# EAGLE board 1-13-2013 (EAGLE 6.4)
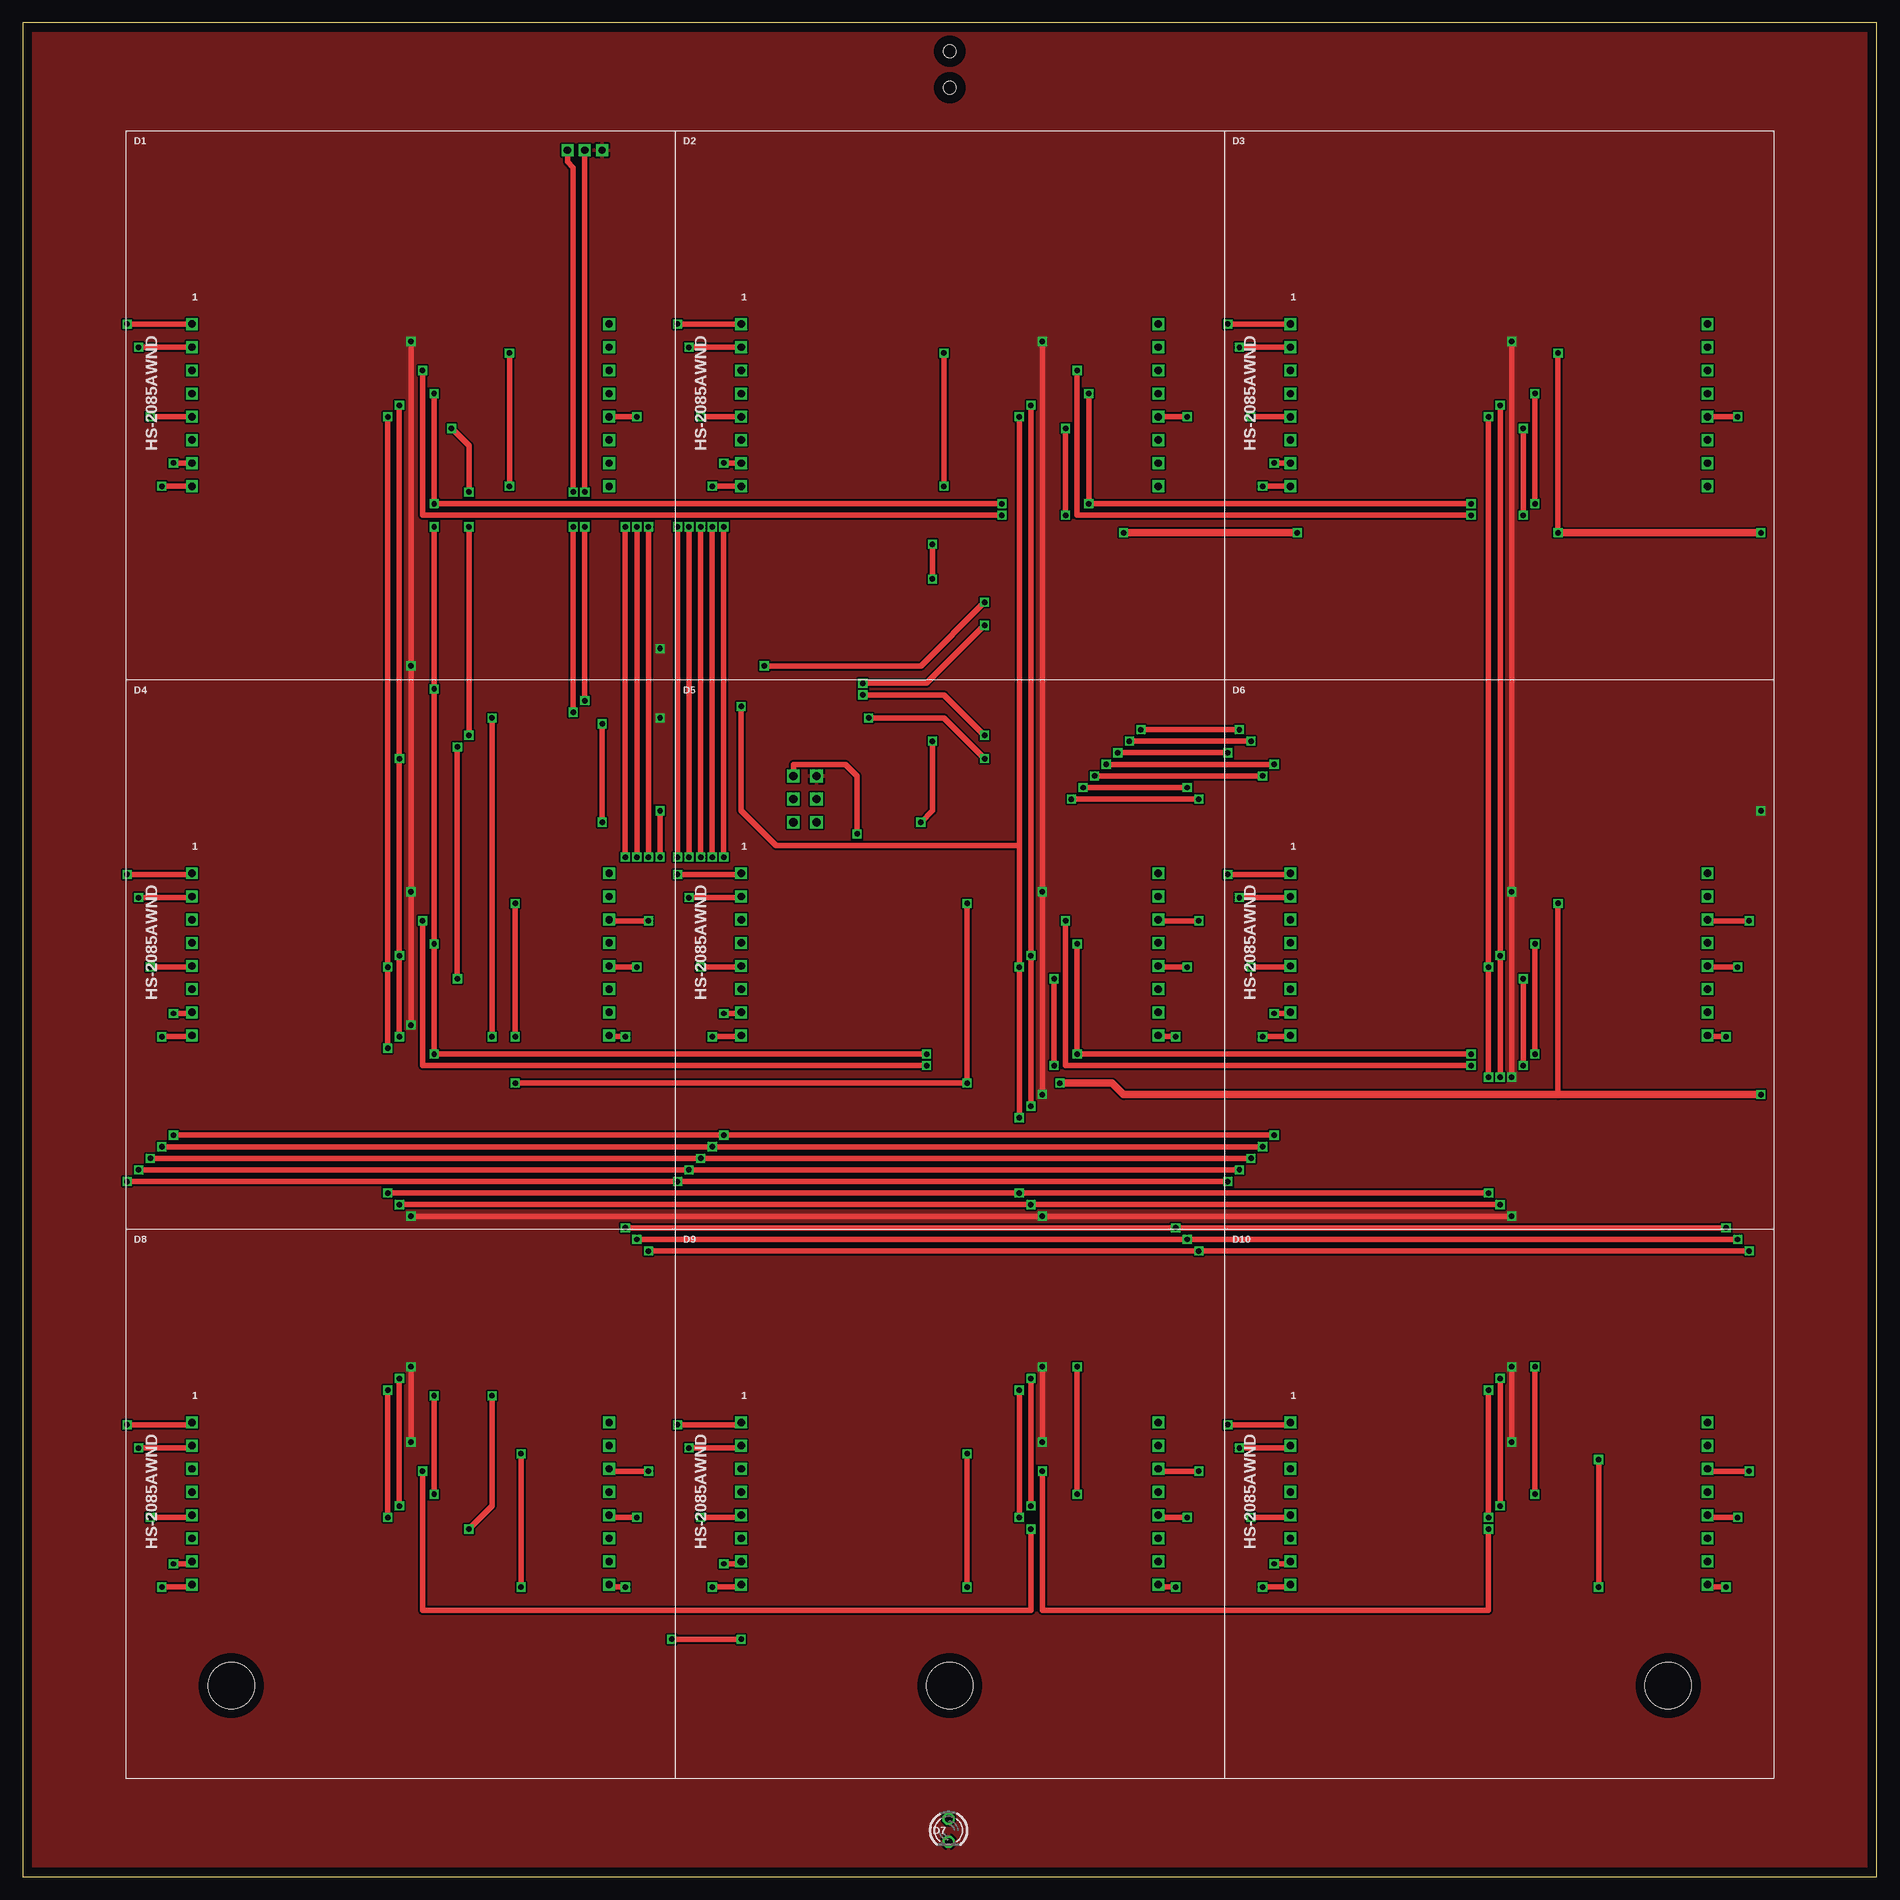
[diagram p2: board, top side]
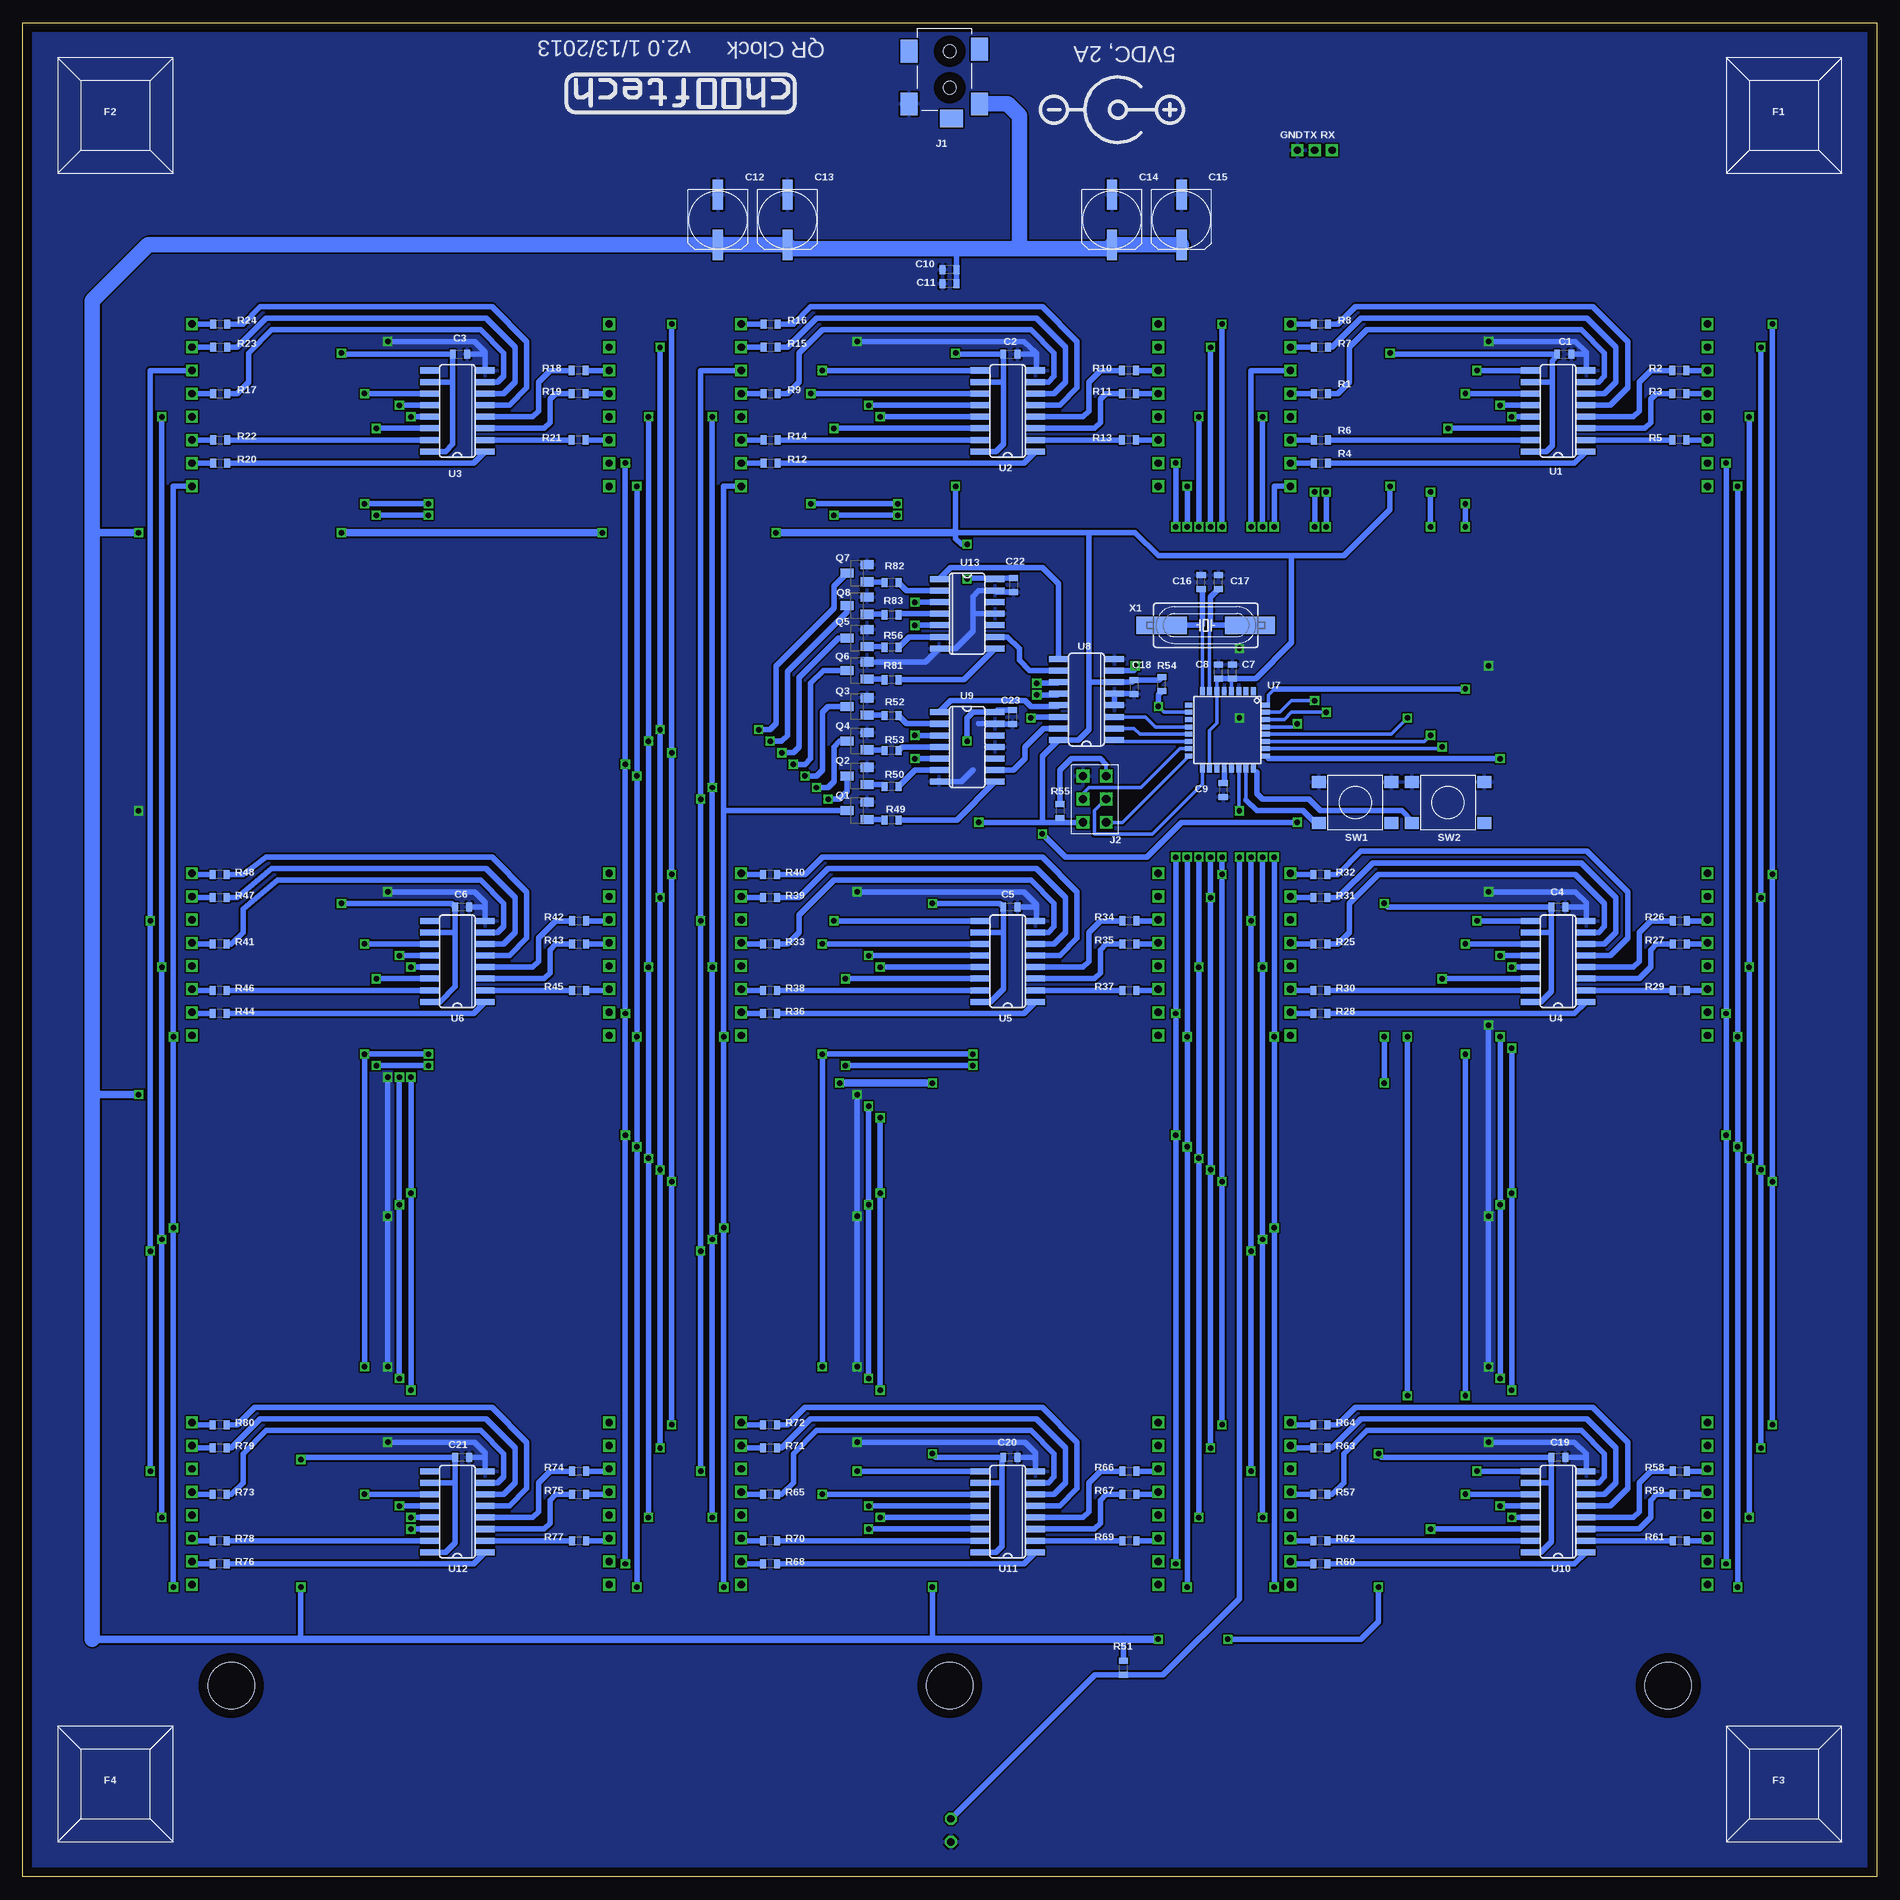
[diagram p3: board, bottom side, seen from below]

Size 203.2 x 203.2 mm. Coordinates in mm from the lower left corner, seen from the top.
Outline: 0,0 203.2,0 203.2,203.2 0,203.2 0,0
Copper layers (1*16): Top 0.035mm / dielectric 1.5mm / Bottom 0.035mm
Design rules "default *": minimum track width 10mil, minimum drill 6mil, track to track 8mil, track to pad 8mil, pad to pad 8mil, via to via 8mil, smd to smd 8mil, copper to edge 40mil, drill to drill 8mil, minimum pad ring 10mil, minimum via ring 8mil, stop-mask expansion 4mil, vias tented up to drill 25mil, thermal gap 10mil
Holes 5.08 mm at 101.6,20.95 180.34,20.95 22.86,20.95

## Footprints (pad centres in the part's own frame; a part is rotated, then mirrored left to right if it is on the bottom)
0603/1608METRIC = smd 0.65 x 1: P1 -0.74,0; P2 0.8,0
CAP-UWX-6.3 = smd 1.143 x 3.302: + 0,2.751; - 0,-2.751
HS-2085BX = drill 0.8 square: P1 -22.86,8.89; P2 -22.86,6.35; P3 -22.86,3.81; P4 -22.86,1.27; P5 -22.86,-1.27; P6 -22.86,-3.81; P7 -22.86,-6.35; P8 -22.86,-8.89; P9 22.86,-8.89; P10 22.86,-6.35; P11 22.86,-3.81; P12 22.86,-1.27; P13 22.86,1.27; P14 22.86,3.81; P15 22.86,6.35; P16 22.86,8.89
LED3MM = drill 0.813 octagon: A -1.27,0; K 1.27,0
HEADERPIN = drill 0.8 square: P$1 0,0
PJ-075DH-SMT-TR = smd 2.489 x 1.88: 1 8.255,3.251; 2 8.255,-4.47; NC1 2.261,3.251; NC2 2.489,-4.47 | smd 1.88 x 2.489: 3 9.855,0.203 | hole 1.397: 2.489,0; 6.477,0
ATMEL-PROGRAMMING-HEADER = drill 0.9 square: P1 -2.54,-1.27; P2 -2.54,1.27; P3 0,-1.27; P4 0,1.27; P5 2.54,-1.27; P6 2.54,1.27
SOT23 = smd 1 x 1.4: 1 -0.95,-1.1; 2 0.95,-1.1; 3 0,1.1
PTS645SM43SMTRLFS = smd 1.549 x 1.295: P1 -3.975,2.248; P2 3.975,2.248; P3 -3.975,-2.248; P4 3.975,-2.248
SO16 = smd 0.66 x 2.032: 1 -4.445,-3.073; 2 -3.175,-3.073; 3 -1.905,-3.073; 4 -0.635,-3.073; 5 0.635,-3.073; 6 1.905,-3.073; 7 3.175,-3.073; 8 4.445,-3.073; 9 4.445,3.073; 10 3.175,3.073; 11 1.905,3.073; 12 0.635,3.073; 13 -0.635,3.073; 14 -1.905,3.073; 15 -3.175,3.073; 16 -4.445,3.073
TQFP-32 = smd 0.85 x 0.54: P1 -4.22,2.8; P2 -4.22,2; P3 -4.22,1.2; P4 -4.22,0.4; P5 -4.22,-0.4; P6 -4.22,-1.2; P7 -4.22,-2; P8 -4.22,-2.8; P17 4.28,-2.8; P18 4.28,-2; P19 4.28,-1.2; P20 4.28,-0.4; P21 4.28,0.4; P22 4.28,1.2; P23 4.28,2; P24 4.28,2.8 | smd 0.54 x 0.85: P9 -2.7,-4.28; P10 -1.9,-4.28; P11 -1.1,-4.28; P12 -0.3,-4.28; P13 0.5,-4.28; P14 1.3,-4.28; P15 2.1,-4.28; P16 2.9,-4.28; P25 2.9,4.18; P26 2.1,4.18; P27 1.3,4.18; P28 0.5,4.18; P29 -0.3,4.18; P30 -1.1,4.18; P31 -1.9,4.18; P32 -2.7,4.18
SO14 = smd 0.66 x 2.032: 1 -3.81,-3.073; 2 -2.54,-3.073; 3 -1.27,-3.073; 4 0,-3.073; 5 1.27,-3.073; 6 2.54,-3.073; 7 3.81,-3.073; 8 3.81,3.073; 9 2.54,3.073; 10 1.27,3.073; 11 0,3.073; 12 -1.27,3.073; 13 -2.54,3.073; 14 -3.81,3.073
HC49UP = smd 5.5 x 1.93: 1 -4.826,0; 2 4.826,0

## Placement (x,y rotation side)
C1  .1uF  [0603/1608METRIC]  34.29,166.88 0 bottom
C2  .1uF  [0603/1608METRIC]  95,166.88 0 bottom
C3  .1uF  [0603/1608METRIC]  155.32,166.88 0 bottom
C4  .1uF  [0603/1608METRIC]  34.92,106.3 0 bottom
C5  .1uF  [0603/1608METRIC]  95,106.3 0 bottom
C6  .1uF  [0603/1608METRIC]  155.07,106.3 0 bottom
C7  .1uF  [0603/1608METRIC]  70.61,132.08 90 bottom
C8  .1uF  [0603/1608METRIC]  72.14,132.08 90 bottom
C9  .1uF  [0603/1608METRIC]  71.63,119.13 270 bottom
C10  1uF  [0603/1608METRIC]  101.6,176.15 180 bottom
C11  1uF  [0603/1608METRIC]  101.6,174.62 180 bottom
C12  100uF  [CAP-UWX-6.3]  127,181.61 180 bottom
C13  100uF  [CAP-UWX-6.3]  119.38,181.61 180 bottom
C14  100uF  [CAP-UWX-6.3]  83.82,181.61 180 bottom
C15  100uF  [CAP-UWX-6.3]  76.2,181.61 180 bottom
C16  22pF  [0603/1608METRIC]  74.04,141.86 90 bottom
C17  22pF  [0603/1608METRIC]  72.14,141.86 90 bottom
C18  .1uF  [0603/1608METRIC]  81.41,130.43 270 bottom
C19  .1uF  [0603/1608METRIC]  34.92,45.97 0 bottom
C20  .1uF  [0603/1608METRIC]  95,45.97 0 bottom
C21  .1uF  [0603/1608METRIC]  155.07,45.97 0 bottom
C22  .1uF  [0603/1608METRIC]  94.61,141.6 270 bottom
C23  .1uF  [0603/1608METRIC]  94.74,127.13 270 bottom
D1  WHITE  [HS-2085BX]  41.4,161.29 0 top
D2  WHITE  [HS-2085BX]  101.6,161.29 0 top
D3  WHITE  [HS-2085BX]  161.8,161.29 0 top
D4  WHITE  [HS-2085BX]  41.4,101.09 0 top
D5  WHITE  [HS-2085BX]  101.6,101.09 0 top
D6  WHITE  [HS-2085BX]  161.8,101.09 0 top
D7  TEPT4400  [LED3MM]  101.47,5.08 270 top
D8  WHITE  [HS-2085BX]  41.4,40.89 0 top
D9  WHITE  [HS-2085BX]  101.6,40.89 0 top
D10  WHITE  [HS-2085BX]  161.8,40.89 0 top
F1  RUBBER-FOOT  [SJ-5518]  10.16,193.04 0 bottom
F2  RUBBER-FOOT  [SJ-5518]  193.04,193.04 0 bottom
F3  RUBBER-FOOT  [SJ-5518]  10.16,10.16 0 bottom
F4  RUBBER-FOOT  [SJ-5518]  193.04,10.16 0 bottom
GND  HEADERPIN  [HEADERPIN]  63.5,189.23 0 bottom
J1  DC-BARREL-JACK-SWITCH  [PJ-075DH-SMT-TR]  101.6,202.56 270 bottom
J2  PROGHEADER-PINS  [ATMEL-PROGRAMMING-HEADER]  85.72,118.11 90 bottom
Q1  FDN335  [SOT23]  111.76,116.84 90 bottom
Q2  FDN335  [SOT23]  111.76,120.65 90 bottom
Q3  FDN335  [SOT23]  111.76,128.27 90 bottom
Q4  FDN335  [SOT23]  111.76,124.46 90 bottom
Q5  FDN335  [SOT23]  111.76,135.76 90 bottom
Q6  FDN335  [SOT23]  111.76,132.21 90 bottom
Q7  FDN335  [SOT23]  111.76,142.88 90 bottom
Q8  FDN335  [SOT23]  111.76,139.32 90 bottom
R1  62  [0603/1608METRIC]  60.96,162.56 0 bottom
R2  62  [0603/1608METRIC]  21.59,165.1 180 bottom
R3  62  [0603/1608METRIC]  21.59,162.56 180 bottom
R4  62  [0603/1608METRIC]  60.96,154.94 0 bottom
R5  62  [0603/1608METRIC]  21.59,157.48 180 bottom
R6  62  [0603/1608METRIC]  60.96,157.48 0 bottom
R7  62  [0603/1608METRIC]  60.96,167.64 0 bottom
R8  62  [0603/1608METRIC]  60.96,170.18 0 bottom
R9  62  [0603/1608METRIC]  121.28,162.56 0 bottom
R10  62  [0603/1608METRIC]  81.92,165.1 180 bottom
R11  62  [0603/1608METRIC]  81.92,162.56 180 bottom
R12  62  [0603/1608METRIC]  121.28,154.94 0 bottom
R13  62  [0603/1608METRIC]  81.92,157.48 180 bottom
R14  62  [0603/1608METRIC]  121.28,157.48 0 bottom
R15  62  [0603/1608METRIC]  121.28,167.64 0 bottom
R16  62  [0603/1608METRIC]  121.28,170.18 0 bottom
R17  62  [0603/1608METRIC]  181.61,162.56 0 bottom
R18  62  [0603/1608METRIC]  142.24,165.1 180 bottom
R19  62  [0603/1608METRIC]  142.24,162.56 180 bottom
R20  62  [0603/1608METRIC]  181.61,154.94 0 bottom
R21  62  [0603/1608METRIC]  142.24,157.48 180 bottom
R22  62  [0603/1608METRIC]  181.61,157.48 0 bottom
R23  62  [0603/1608METRIC]  181.61,167.64 0 bottom
R24  62  [0603/1608METRIC]  181.61,170.18 0 bottom
R25  62  [0603/1608METRIC]  60.96,102.23 180 bottom
R26  62  [0603/1608METRIC]  21.59,104.78 0 bottom
R27  62  [0603/1608METRIC]  21.59,102.23 0 bottom
R28  62  [0603/1608METRIC]  60.96,94.61 180 bottom
R29  62  [0603/1608METRIC]  21.59,97.16 0 bottom
R30  62  [0603/1608METRIC]  60.96,97.16 180 bottom
R31  62  [0603/1608METRIC]  60.96,107.31 180 bottom
R32  62  [0603/1608METRIC]  60.96,109.86 180 bottom
R33  62  [0603/1608METRIC]  121.28,102.23 180 bottom
R34  62  [0603/1608METRIC]  81.92,104.78 0 bottom
R35  62  [0603/1608METRIC]  81.92,102.23 0 bottom
R36  62  [0603/1608METRIC]  121.28,94.61 180 bottom
R37  62  [0603/1608METRIC]  81.92,97.16 0 bottom
R38  62  [0603/1608METRIC]  121.28,97.16 180 bottom
R39  62  [0603/1608METRIC]  121.28,107.31 180 bottom
R40  62  [0603/1608METRIC]  121.28,109.86 180 bottom
R41  62  [0603/1608METRIC]  181.61,102.23 180 bottom
R42  62  [0603/1608METRIC]  142.24,104.78 0 bottom
R43  62  [0603/1608METRIC]  142.24,102.23 0 bottom
R44  62  [0603/1608METRIC]  181.61,94.61 180 bottom
R45  62  [0603/1608METRIC]  142.24,97.16 0 bottom
R46  62  [0603/1608METRIC]  181.61,97.16 180 bottom
R47  62  [0603/1608METRIC]  181.61,107.31 180 bottom
R48  62  [0603/1608METRIC]  181.61,109.86 180 bottom
R49  2k  [0603/1608METRIC]  107.95,115.82 180 bottom
R50  2k  [0603/1608METRIC]  107.95,119.51 180 bottom
R51  47k  [0603/1608METRIC]  82.55,22.86 90 bottom
R52  2k  [0603/1608METRIC]  107.95,127.25 180 bottom
R53  2k  [0603/1608METRIC]  107.95,123.44 180 bottom
R54  10k  [0603/1608METRIC]  78.36,130.68 90 bottom
R55  4.7k  [0603/1608METRIC]  89.53,116.84 270 bottom
R56  2k  [0603/1608METRIC]  107.95,134.75 180 bottom
R57  62  [0603/1608METRIC]  60.96,41.91 180 bottom
R58  62  [0603/1608METRIC]  21.59,44.45 0 bottom
R59  62  [0603/1608METRIC]  21.59,41.91 0 bottom
R60  62  [0603/1608METRIC]  60.96,34.29 180 bottom
R61  62  [0603/1608METRIC]  21.59,36.83 0 bottom
R62  62  [0603/1608METRIC]  60.96,36.83 180 bottom
R63  62  [0603/1608METRIC]  60.96,46.99 180 bottom
R64  62  [0603/1608METRIC]  60.96,49.53 180 bottom
R65  62  [0603/1608METRIC]  121.28,41.91 180 bottom
R66  62  [0603/1608METRIC]  81.92,44.45 0 bottom
R67  62  [0603/1608METRIC]  81.92,41.91 0 bottom
R68  62  [0603/1608METRIC]  121.28,34.29 180 bottom
R69  62  [0603/1608METRIC]  81.92,36.83 0 bottom
R70  62  [0603/1608METRIC]  121.28,36.83 180 bottom
R71  62  [0603/1608METRIC]  121.28,46.99 180 bottom
R72  62  [0603/1608METRIC]  121.28,49.53 180 bottom
R73  62  [0603/1608METRIC]  181.61,41.91 180 bottom
R74  62  [0603/1608METRIC]  142.24,44.45 0 bottom
R75  62  [0603/1608METRIC]  142.24,41.91 0 bottom
R76  62  [0603/1608METRIC]  181.61,34.29 180 bottom
R77  62  [0603/1608METRIC]  142.24,36.83 0 bottom
R78  62  [0603/1608METRIC]  181.61,36.83 180 bottom
R79  62  [0603/1608METRIC]  181.61,46.99 180 bottom
R80  62  [0603/1608METRIC]  181.61,49.53 180 bottom
R81  2k  [0603/1608METRIC]  107.95,131.19 180 bottom
R82  2k  [0603/1608METRIC]  107.95,141.86 180 bottom
R83  2k  [0603/1608METRIC]  107.95,138.3 180 bottom
RX  HEADERPIN  [HEADERPIN]  59.69,189.23 0 bottom
SW1  4mm  [PTS645SM43SMTRLFS]  57.15,117.73 180 bottom
SW2  4mm  [PTS645SM43SMTRLFS]  46.99,117.73 180 bottom
TX  HEADERPIN  [HEADERPIN]  61.59,189.23 0 bottom
U1  74HC595  [SO16]  34.92,160.66 90 bottom
U2  74HC595  [SO16]  95.25,160.66 90 bottom
U3  74HC595  [SO16]  155.57,160.66 90 bottom
U4  74HC595  [SO16]  34.92,100.33 90 bottom
U5  74HC595  [SO16]  95.25,100.33 90 bottom
U6  74HC595  [SO16]  155.57,100.33 90 bottom
U7  ATMega328A  [TQFP-32]  71.12,125.73 270 bottom
U8  74HC138  [SO16]  86.61,129.03 90 bottom
U9  74HC14  [SO14]  99.69,123.83 270 bottom
U10  74HC595  [SO16]  34.92,40.01 90 bottom
U11  74HC595  [SO16]  95.25,40.01 90 bottom
U12  74HC595  [SO16]  155.57,40.01 90 bottom
U13  74HC14  [SO14]  99.69,138.43 270 bottom
X1  11.0592MHz  [HC49UP]  73.53,137.16 180 bottom

## Tracks (layer width: path | path; a pad name or v marks a point on that pad's centre or on a via)
!OE  (via drill 0.6)
  Top 0.61: v40.01,160.02 v40.01,99.69 v40.01,90.81 | v40.01,39.37 v40.01,53.34 | v109.22,39.37 v109.22,53.34 | v109.22,83.19 v109.22,99.69 109.22,113.03 | 109.22,113.03 v109.22,160.02 | v160.66,39.37 v160.66,53.34 | v160.66,87.63 v160.66,99.69 v160.66,160.02 | v40.01,74.93 v109.22,74.93 v160.66,74.93 | v78.74,128.27 78.74,116.84 82.55,113.03 109.22,113.03
  Bottom 0.406: U7.P10 78.1,127.63 v78.74,128.27
  Bottom 0.61: U1.13 v40.01,160.02 | v40.01,99.69 U4.13 | U10.13 v40.01,39.37 | v40.01,53.34 v40.01,74.93 v40.01,90.81 | U11.13 v109.22,39.37 | v109.22,53.34 v109.22,74.93 v109.22,83.19 | v109.22,160.02 U2.13 | U5.13 v109.22,99.69 | U12.13 v160.66,39.37 | v160.66,53.34 v160.66,74.93 v160.66,87.63 | U3.13 v160.66,160.02 | U6.13 v160.66,99.69 | v78.74,128.27 78.74,129.56 R54.P1
!RESET  (via drill 0.6)
  Top 0.61: v63.5,115.57 v63.5,126.36 | J2.P5 84.45,121.92 90.17,121.92 91.44,120.65 v91.44,114.3
  Bottom 0.406: v63.5,126.36 63.84,126.03 U7.P29 | 84.45,121.92 J2.P5
  Bottom 0.61: R55.P1 89.53,121.28 88.27,122.56 85.09,122.56 84.45,121.92 | v63.5,115.57 76.2,115.57 80.01,111.76 88.9,111.76 v91.44,114.3
+5V  (via drill 0.6)
  Top 0.61: v168.28,167 v168.28,147.32 | v100.97,152.4 v100.97,167 | v53.34,152.4 v53.34,167 | 168.28,85.72 v168.28,106.68 | v103.5,106.68 v103.5,87 v53.98,87 | v53.98,92.08 v53.98,106.68 | v78.74,26.04 v71.12,26.04 | v54.61,31.75 v54.61,46.35 | v103.5,31.75 v103.5,46.35 | v172.72,31.75 v172.72,45.72 | v99.69,142.24 v99.69,146.05 | v99.69,124.46 99.69,116.84 v98.42,115.57
  Top 0.813: v168.28,147.32 v190.5,147.32 | v139.7,147.32 v120.65,147.32 | v190.5,85.72 168.28,85.72 120.65,85.72 119.38,87 v113.67,87
  Bottom 0.406: 72.32,131.16 U7.P6 72.32,126.44 73.12,125.64 U7.P18 | U7.P4 70.72,131.23 | R55.P2 89.53,115.57
  Bottom 0.61: U1.16 36.2,156.21 35.56,156.84 35.56,163.83 | U2.16 96.52,156.21 95.74,156.99 95.74,163.83 | 95.74,163.83 U2.10 | U3.16 156.84,156.21 156.06,156.99 156.06,163.83 | 156.06,163.83 U3.10 | U1.10 35.56,163.83 | 35.56,163.83 35.56,166.09 C1.P1 53.21,166.88 v53.34,167 | U4.16 36.83,95.89 35.66,97.05 35.66,103.5 | U10.16 36.83,35.56 35.66,36.73 35.66,43.18 | 35.66,43.18 C19.P1 54.23,45.97 v54.61,46.35 | U10.10 35.66,43.18 | 35.66,103.5 C4.P1 53.59,106.3 v53.98,106.68 | U4.10 35.66,103.5 | 95.74,163.83 C2.P1 100.84,166.88 v100.97,167 | 156.06,163.83 C3.P1 168.15,166.88 v168.28,167 | U11.16 96.52,35.56 95.89,36.2 95.89,43.18 | 95.89,43.18 95.89,45.83 C20.P1 103.12,45.97 v103.5,46.35 | U11.10 95.89,43.18 | U6.16 157.48,95.89 155.81,97.56 155.81,103.5 | 155.81,103.5 C6.P1 156.19,106.68 v168.28,106.68 | U6.10 155.81,103.5 | U12.16 156.84,35.56 155.81,36.6 155.81,43.18 | 155.81,43.18 C21.P1 172.47,45.97 v172.72,45.72 | U12.10 155.81,43.18 | C23.P1 96.39,127.87 U9.14 99.06,127.64 99.69,127 v99.69,124.46 | C22.P1 96.52,142.34 | 96.52,142.34 U13.14 | v100.97,152.4 100.97,147.32 | 100.97,147.32 86.36,147.32 | 86.36,147.32 81.28,147.32 78.74,144.78 64.14,144.78 | 64.14,144.78 58.42,144.78 53.34,149.86 v53.34,152.4 | v103.5,106.68 96.12,106.68 C5.P1 95.74,103.5 | U5.16 97.16,95.89 95.74,97.3 95.74,103.5 | U5.10 95.74,103.5 | v53.98,87 v53.98,92.08 | v71.12,26.04 56.52,26.04 54.61,27.94 v54.61,31.75 | 103.5,26.04 v103.5,31.75 | 172.72,26.04 v172.72,31.75 | 91.44,115.57 91.44,122.83 U8.16 87.5,124.59 86.36,125.73 86.36,130.94 | 96.52,142.34 99.59,142.34 v99.69,142.24 | v99.69,146.05 100.33,146.05 100.97,146.69 100.97,147.32
  Bottom 0.61: 86.36,130.94 U8.6 81.64,130.94 C18.P1 78.67,131.17 R54.P2 | 72.32,131.16 C8.P1 70.83,131.34 70.72,131.23 C7.P1 68.05,131.34 64.14,135.25 64.14,144.78 | 91.44,115.57 v98.42,115.57 | 86.36,130.94 86.36,147.32 | C11.P1 C10.P1 100.86,177.91 100.33,178.44 | R51.P2 82.55,26.04 | 91.44,115.57 89.53,115.57 J2.P2
  Bottom 0.813: v190.5,147.32 195.58,147.32 | v168.28,147.32 v139.7,147.32 | v120.65,147.32 100.97,147.32 | 195.58,85.72 v190.5,85.72 | 195.58,26.04 172.72,26.04 103.5,26.04 82.55,26.04 v78.74,26.04 | v103.5,87 v113.67,87
  Bottom 1.27: 84.24,178.44 C14.+ | C13.+ 118.96,178.44
  Bottom 1.676: J1.1 95.25,194.31 93.98,193.04 93.98,178.44 | 93.98,178.44 84.24,178.44 | C14.+ C15.+ | C13.+ C12.+ 189.44,178.86 195.58,172.72 195.58,147.32 195.58,85.72 195.58,26.04 | 118.96,178.44 100.33,178.44 93.98,178.44
GND  (via drill 0.6)
  Top 0.61: v111.76,47.62 v111.76,55.88 | v111.76,85.72 v111.76,107.95 v111.76,168.28 | v42.55,47.62 v42.55,55.88 | v42.55,93.34 v42.55,107.95 v42.55,132.72 v42.55,168.28 | v163.19,47.62 v163.19,55.88 | v163.19,87.63 v163.19,107.95 v163.19,168.28 | v42.55,72.39 v111.76,72.39 v163.19,72.39
  Bottom 0.61: v111.76,55.88 v111.76,72.39 v111.76,85.72 | v111.76,168.28 93.45,168.28 92.08,167 | 92.08,167 92.08,165.2 U2.8 | U10.8 31.85,45.72 | 31.85,45.72 31.85,46.35 33.12,47.62 v42.55,47.62 | v42.55,55.88 v42.55,72.39 v42.55,93.34 | v163.19,55.88 v163.19,72.39 v163.19,87.63 | U1.8 31.85,167 | 31.85,167 31.85,167.11 33.02,168.28 v42.55,168.28 | U4.8 31.85,106.05 | 31.85,106.05 31.85,106.78 33.02,107.95 v42.55,107.95 | C4.P2 32.11,106.3 31.85,106.05 | U3.8 152.5,167 | 152.5,167 152.5,167.11 153.67,168.28 v163.19,168.28 | C1.P2 31.98,166.88 31.85,167 | C2.P2 92.2,166.88 92.08,167 | C3.P2 152.63,166.88 152.5,167 | U5.8 92.08,104.88 92.08,106.05 | 92.08,106.05 92.08,106.55 93.47,107.95 v111.76,107.95 | C5.P2 92.33,106.3 92.08,106.05 | C19.P2 32.11,45.97 31.85,45.72 | U11.8 92.18,45.72 | 92.18,45.72 92.18,46.46 93.34,47.62 v111.76,47.62 | C20.P2 92.43,45.97 92.18,45.72 | U6.8 152.5,106.05 | 152.5,106.05 152.5,106.78 153.67,107.95 v163.19,107.95 | C6.P2 152.76,106.3 152.5,106.05 | U12.8 152.5,45.72 | 152.5,45.72 152.5,46.46 153.67,47.62 v163.19,47.62 | C21.P2 152.76,45.97 152.5,45.72 | 98.42,126.36 U9.13 96.58,126.33 C23.P2 | U9.7 100.33,120.02 99.06,121.28 | 99.06,138.43 99.06,136.53 100.97,134.62 U13.7 104.23,133.16 Q6.2 | 99.06,138.43 99.06,140.34 98.42,140.97 U13.13 96.46,140.81 C22.P2 | U13.11 99.06,138.43 | U8.5 U8.4 | C18.P2 81.44,129.67 U8.5 | 83.67,129.54 U8.5
  other vias: 190.5,116.84 69.85,127 69.85,134.62
  pour Bottom: -0.13,203.07 0.51,0.51 202.69,0.51 202.06,203.07
  pour Top: 0.25,203.33 0.25,0.25 202.95,0.25 202.95,203.33
MISO
  Bottom 0.406: U7.P16 82.66,115.57 J2.P1
MOSI
  Bottom 0.406: U7.P15 76.39,123.63 80.64,119.38 86.36,119.38 87,118.75 J2.P4
N$1
  Bottom 0.61: D1.P13 R1.P1
N$2
  Bottom 0.61: R4.P2 33.12,154.94 U1.1
N$3
  Bottom 0.61: D1.P3 R2.P1
N$4
  Bottom 0.61: R5.P2 U1.2
N$5
  Bottom 0.61: D1.P4 R3.P1
N$6
  Bottom 0.61: U2.15 R14.P2
N$7
  Bottom 0.61: D1.P10 R4.P1
N$8
  Bottom 0.61: R13.P2 U2.2
N$9
  Bottom 0.61: D1.P6 R5.P1
N$10
  Bottom 0.61: R12.P2 93.45,154.94 U2.1
N$11
  Bottom 0.61: D1.P11 R6.P1
N$12
  Bottom 0.61: R11.P2 84.45,162.56 85.09,161.93 85.09,159.38 85.72,158.75 U2.3
N$13
  Bottom 0.61: D1.P15 R7.P1
N$14
  Bottom 0.61: U2.4 87,160.02 86.36,160.66 86.36,163.83 85.09,165.1 R10.P2
N$15
  Bottom 0.61: D1.P16 R8.P1
N$16
  Bottom 0.61: R16.P2 118.75,170.18 116.84,172.09 91.44,172.09 87.63,168.28 87.63,163.19 89.53,161.29 U2.5
N$17
  Bottom 0.61: U9.9 94.61,121.28 93.34,122.56 93.34,123.83 91.31,125.86 U8.15
N$18
  Bottom 0.61: R9.P1 D2.P13
N$19
  Bottom 0.61: R21.P2 U3.2
N$20
  Bottom 0.61: R10.P1 D2.P3
N$21
  Bottom 0.61: R20.P2 153.77,154.94 U3.1
N$22
  Bottom 0.61: R11.P1 D2.P4
N$23
  Bottom 0.61: R19.P2 144.78,162.56 145.41,161.93 145.41,159.38 146.05,158.75 U3.3
N$24
  Bottom 0.61: R12.P1 D2.P10
N$25
  Bottom 0.61: R18.P2 145.41,165.1 146.69,163.83 146.69,160.66 147.32,160.02 U3.4
N$26
  Bottom 0.61: R13.P1 D2.P6
N$27
  Bottom 0.61: R24.P2 179.07,170.18 177.16,172.09 151.76,172.09 147.96,168.28 147.96,163.19 149.86,161.29 U3.5
N$28
  Bottom 0.61: R14.P1 D2.P11
N$29
  Bottom 0.61: R32.P1 59.05,109.86 56.52,112.39 31.75,112.39 27.3,107.95 27.3,102.87 29.21,100.97 U4.5
N$30
  Bottom 0.61: R15.P1 D2.P15
N$31
  Bottom 0.61: U4.7 30.48,103.5 29.84,104.14 29.84,106.68 33.02,109.86 54.61,109.86 57.78,106.68 57.78,103.5 59.05,102.23 R25.P1
N$32
  Bottom 0.61: R16.P1 D2.P16
N$33
  Bottom 0.61: U9.2 106.32,126.36 R52.P1
N$34
  Bottom 0.61: U9.6 105.43,121.28 R50.P1
N$35
  Bottom 0.61: U9.8 100.81,115.82 R49.P1
N$36
  Bottom 0.61: U9.4 106.83,123.83 R53.P1
N$37
  Bottom 0.61: U13.4 107.08,138.43 R83.P1
N$38
  Bottom 0.61: U13.2 106.32,140.97 R82.P1
N$39
  Bottom 0.61: U13.8 100.05,131.19 R81.P1
N$40
  Bottom 0.61: U13.6 106.07,135.89 R56.P1
N$41
  Bottom 0.406: U7.P7 73.12,137.83 73.03,137.83
  Bottom 0.61: X1.1 73.03,137.16 73.03,137.83 73.03,140.23 C17.P1
N$42
  Bottom 0.61: R7.P2 59.69,167.64 56.52,170.81 31.75,170.81 28.57,167.64 28.57,163.83 29.84,162.56 U1.6
N$43  (via drill 0.6)
  Top 0.61: v61.59,128.91 v61.59,147.96 | v61.59,151.76 TX.P$1
  Bottom 0.406: U7.P31 65.41,127.63 64.14,128.91 v61.59,128.91
  Bottom 0.61: v61.59,147.96 v61.59,151.76
N$44
  Bottom 0.406: U7.P8 73.92,137.16
  Bottom 0.61: X1.2 73.92,137.16 73.92,141 C16.P1
N$45  (via drill 0.6)
  Top 0.61: v60.33,127.64 v60.33,147.96 | v60.33,151.76 60.33,187.32 59.69,187.96 RX.P$1
  Bottom 0.406: U7.P30 64.94,126.83 64.14,127.64 v60.33,127.64
  Bottom 0.61: v60.33,147.96 v60.33,151.76
N$46
  Bottom 0.61: R52.P2 108.82,127.32 Q3.1
N$47
  Bottom 0.406: 67.94,121.08 U7.P24
  Bottom 0.61: SW2.P2 50.97,115.73 52.07,116.84 60.96,116.84 62.23,118.11 67.31,118.11 67.94,118.75 67.94,121.08
N$48
  Bottom 0.406: U7.P23 69.12,118.02
  Bottom 0.61: SW1.P2 61.51,115.48 62.87,116.84 67.94,116.84 69.12,118.02
N$49
  Bottom 0.61: R1.P2 59.05,162.56 57.78,163.83 57.78,167.64 55.88,169.54 32.38,169.54 29.84,167 29.84,164.47 30.48,163.83 U1.7
N$50
  Bottom 0.61: R49.P2 108.82,115.89 Q1.1
N$51
  Bottom 0.61: R8.P2 59.05,170.18 57.15,172.09 31.11,172.09 27.3,168.28 27.3,163.19 29.21,161.29 U1.5
N$52
  Bottom 0.61: R2.P2 24.77,165.1 26.04,163.83 26.04,160.66 26.67,160.02 U1.4
N$53
  Bottom 0.61: R3.P2 24.13,162.56 24.77,161.93 24.77,159.38 25.4,158.75 U1.3
N$54
  Bottom 0.61: R31.P1 59.05,107.31 55.24,111.12 32.38,111.12 28.57,107.31 28.57,103.5 29.84,102.23 U4.6
N$55
  Bottom 0.61: R26.P1 24.77,104.78 26.04,103.5 26.04,100.33 26.67,99.69 U4.4
N$56
  Bottom 0.61: R6.P2 U1.15
N$57
  Bottom 0.61: R27.P1 24.13,102.23 24.77,101.6 24.77,99.69 26.04,98.42 U4.3
N$58
  Bottom 0.61: R29.P1 U4.2
N$59
  Bottom 0.61: R30.P1 U4.15
N$60
  Bottom 0.61: U5.7 90.81,103.5 90.17,104.14 90.17,106.68 92.71,109.22 114.3,109.22 118.11,105.41 118.11,103.5 119.38,102.23 R33.P1
N$61
  Bottom 0.61: U5.6 90.17,102.23 88.9,103.5 88.9,107.31 92.08,110.49 114.94,110.49 118.11,107.31 R39.P1
N$62
  Bottom 0.61: U5.5 89.53,100.97 87.63,102.87 87.63,107.95 91.44,111.76 115.57,111.76 117.47,109.86 R40.P1
N$63
  Bottom 0.61: R34.P1 85.09,104.78 86.36,103.5 86.36,100.33 87,99.69 U5.4
N$64
  Bottom 0.61: R35.P1 84.45,102.23 85.09,101.6 85.09,99.06 85.72,98.42 U5.3
N$65
  Bottom 0.61: R36.P1 93.45,94.61 U5.1
N$66
  Bottom 0.61: R37.P1 U5.2
N$67
  Bottom 0.61: U5.15 R38.P1
N$68
  Bottom 0.61: U6.7 151.13,103.5 150.5,104.14 150.5,106.68 153.03,109.22 175.26,109.22 179.07,106.05 179.07,103.5 180.34,102.23 R41.P1
N$69
  Bottom 0.61: R47.P1 179.71,107.31 175.9,110.49 152.4,110.49 149.22,107.31 149.22,103.5 150.5,102.23 U6.6
N$70
  Bottom 0.61: U6.15 R46.P1
N$71
  Bottom 0.61: R45.P1 U6.2
N$72
  Bottom 0.61: R44.P1 153.77,94.61 U6.1
N$73
  Bottom 0.61: R43.P1 144.78,102.23 145.41,101.6 145.41,99.06 146.05,98.42 U6.3
N$74  (via drill 0.6)
  Top 0.61: v105.41,122.56 100.97,127 v92.71,127
  Bottom 0.61: U9.5 v105.41,122.56 | v92.71,127 92.58,127.13 U8.14
N$75  (via drill 0.6)
  Top 0.61: v43.81,104.78 43.81,88.9 v99.06,88.9 | v113.03,88.9 v113.03,98.42
  Bottom 0.61: U4.9 v43.81,104.78 | v99.06,88.9 v113.03,88.9 | v113.03,98.42 U5.14
N$76  (via drill 0.6)
  Top 0.61: v114.3,104.78 114.3,88.9 v158.75,88.9 | v164.47,88.9 v164.47,98.42
  Bottom 0.61: U5.9 v114.3,104.78 | v158.75,88.9 v164.47,88.9 | v164.47,98.42 U6.14
N$77
  Bottom 0.61: U8.13 89.81,128.27 92.71,128.27 93.34,128.91 101.5,128.91 U9.1
N$78  (via drill 0.6)
  Top 0.61: v43.81,165.1 43.81,149.22 v107.31,149.22 | v114.3,149.22 v114.3,158.75
  Bottom 0.61: U1.9 v43.81,165.1 | v107.31,149.22 v114.3,149.22 | v114.3,158.75 U2.14
N$79  (via drill 0.6)
  Top 0.61: v115.57,165.1 115.57,149.22 v158.75,149.22 | v164.47,149.22 v164.47,158.75
  Bottom 0.61: U2.9 v115.57,165.1 | v158.75,149.22 v164.47,149.22 | v164.47,158.75 U3.14
N$80
  Bottom 0.61: R42.P1 144.78,104.78 146.69,102.87 146.69,100.33 147.32,99.69 U6.4
N$81
  Bottom 0.61: U6.5 149.86,100.97 147.96,102.87 147.96,107.95 151.76,111.76 176.53,111.76 179.07,109.86 R48.P1
N$82
  Bottom 0.61: U10.7 30.48,43.18 29.84,43.81 29.84,46.35 32.38,48.9 55.88,48.9 58.42,46.35 58.42,43.18 59.69,41.91 R57.P1
N$83
  Bottom 0.61: R63.P1 59.69,46.99 56.52,50.16 31.75,50.16 28.57,46.99 28.57,43.18 29.84,41.91 U10.6
N$84
  Bottom 0.61: U10.5 29.21,40.64 27.3,42.55 27.3,47.62 31.11,51.44 57.15,51.44 59.05,49.53 R64.P1
N$85
  Bottom 0.61: R58.P1 24.77,44.45 26.04,43.18 26.04,40.01 26.67,39.37 U10.4
N$86
  Bottom 0.61: R59.P1 24.13,41.91 24.77,41.27 24.77,39.37 26.04,38.1 U10.3
N$87
  Bottom 0.61: R15.P2 119.38,167.64 116.2,170.81 92.08,170.81 88.9,167.64 88.9,163.83 90.17,162.56 U2.6
N$88
  Bottom 0.61: R61.P1 U10.2
N$89
  Bottom 0.61: R60.P1 33.12,34.29 U10.1
N$90
  Bottom 0.61: R62.P1 U10.15
N$91
  Bottom 0.61: U11.7 90.81,43.18 90.17,43.81 90.17,46.35 92.71,48.9 116.2,48.9 118.75,46.35 118.75,43.18 120.02,41.91 R65.P1
N$92
  Bottom 0.61: R71.P1 120.02,46.99 116.84,50.16 92.08,50.16 88.9,46.99 88.9,43.18 90.17,41.91 U11.6
N$93
  Bottom 0.61: U11.5 89.53,40.64 87.63,42.55 87.63,47.62 91.44,51.44 117.47,51.44 119.38,49.53 R72.P1
N$94
  Bottom 0.61: R66.P1 85.09,44.45 86.36,43.18 86.36,40.01 87,39.37 U11.4
N$95
  Bottom 0.61: R67.P1 84.45,41.91 85.09,41.27 85.09,38.73 85.72,38.1 U11.3
N$96
  Bottom 0.61: R69.P1 U11.2
N$97
  Bottom 0.61: R9.P2 119.38,162.56 118.11,163.83 118.11,167 115.57,169.54 92.71,169.54 90.17,167 90.17,164.47 90.81,163.83 U2.7
N$98
  Bottom 0.61: R68.P1 93.45,34.29 U11.1
N$99
  Bottom 0.61: R70.P1 U11.15
N$100
  Bottom 0.61: R73.P1 180.34,41.91 179.07,43.18 179.07,46.35 176.53,48.9 153.03,48.9 150.5,46.35 150.5,43.81 151.13,43.18 U12.7
N$101
  Bottom 0.61: U12.6 150.5,41.91 149.22,43.18 149.22,46.99 152.4,50.16 177.16,50.16 180.34,46.99 R79.P1
N$102
  Bottom 0.61: R80.P1 179.71,49.53 177.8,51.44 151.76,51.44 147.96,47.62 147.96,42.55 149.86,40.64 U12.5
N$103
  Bottom 0.61: R74.P1 145.41,44.45 146.69,43.18 146.69,40.01 147.32,39.37 U12.4
N$104
  Bottom 0.61: R75.P1 144.78,41.91 145.41,41.27 145.41,38.73 146.05,38.1 U12.3
N$105
  Bottom 0.61: R77.P1 U12.2
N$106
  Bottom 0.61: R76.P1 153.77,34.29 U12.1
N$107
  Bottom 0.61: R78.P1 U12.15
N$121  (via drill 0.6)
  Top 0.61: v43.81,44.45 43.81,29.21 110.49,29.21 v110.49,38.1
  Bottom 0.61: U10.9 v43.81,44.45 | v110.49,38.1 U11.14
N$122  (via drill 0.6)
  Top 0.61: v111.76,44.45 111.76,29.21 160.66,29.21 v160.66,38.1
  Bottom 0.61: U11.9 v111.76,44.45 | v160.66,38.1 U12.14
N$123  (via drill 0.6)
  Top 0.61: v105.41,125.09 100.97,129.54 v92.08,129.54
  Bottom 0.61: U9.3 v105.41,125.09 | v92.08,129.54 89.81,129.54 U8.12
N$124  (via drill 0.6)
  Top 0.61: v105.41,137.16 99.06,130.81 v92.08,130.81
  Bottom 0.61: U13.5 v105.41,137.16 | v92.08,130.81 89.81,130.81 U8.11
N$125
  Bottom 0.61: U8.10 92.84,132.21 93.98,133.35 93.98,134.62 95.25,135.89 U13.9
N$126
  Bottom 0.61: U13.1 101.5,143.51 91.44,143.51 89.69,141.76 U8.9
N$127  (via drill 0.6)
  Top 0.61: v105.41,139.7 98.42,132.72 v81.28,132.72
  Bottom 0.61: U13.3 v105.41,139.7 | v81.28,132.72 81.41,132.21 U8.7
N$128  (via drill 0.6)
  Top 0.61: v69.85,116.84 v69.85,111.76
  Bottom 0.406: U7.P22 69.92,116.91
  Bottom 0.61: 69.92,116.91 v69.85,116.84 | v69.85,111.76 69.85,30.48 78.21,22.12 R51.P1 85.7,22.12 D7.A
N$129
  Bottom 0.61: R17.P1 D3.P13
N$131
  Bottom 0.61: R18.P1 D3.P3
N$133
  Bottom 0.61: R19.P1 D3.P4
N$135
  Bottom 0.61: R20.P1 D3.P10
N$137
  Bottom 0.61: R21.P1 D3.P6
N$139
  Bottom 0.61: R22.P1 D3.P11
N$141
  Bottom 0.61: R23.P1 D3.P15
N$143
  Bottom 0.61: D3.P16 R24.P1
N$161
  Bottom 0.61: R17.P2 179.71,162.56 178.44,163.83 178.44,167 175.9,169.54 153.03,169.54 150.5,167 150.5,164.47 151.13,163.83 U3.7
N$162
  Bottom 0.61: R23.P2 179.71,167.64 176.53,170.81 152.4,170.81 149.22,167.64 149.22,163.83 150.5,162.56 U3.6
N$168
  Bottom 0.61: R22.P2 U3.15
N$185
  Bottom 0.406: U7.P12 79.04,126.03 80.14,127.13 U8.3
N$186
  Bottom 0.406: U7.P13 80.78,125.23 81.41,125.86 U8.2
N$187
  Bottom 0.406: U7.P14 83.38,124.43 U8.1
N$188
  Bottom 0.61: C9.P1 71.52,119.97 U7.P20
N$193
  Bottom 0.61: R25.P2 64.01,102.23 D4.P13
N$195
  Bottom 0.61: R26.P2 18.54,104.78 D4.P3
N$197
  Bottom 0.61: R27.P2 18.54,102.23 D4.P4
N$199
  Bottom 0.61: R28.P2 64.01,94.61 D4.P10
N$201
  Bottom 0.61: R29.P2 18.54,97.16 D4.P6
N$203
  Bottom 0.61: R30.P2 64.01,97.16 D4.P11
N$205
  Bottom 0.61: R31.P2 64.01,107.31 D4.P15
N$207
  Bottom 0.61: R32.P2 64.01,109.86 D4.P16
N$210
  Bottom 0.61: U4.1 33.12,94.61 R28.P1
N$242
  Bottom 0.61: R82.P2 108.82,141.93 Q7.1
N$243
  Bottom 0.61: R50.P2 108.94,119.7 Q2.1
N$245
  Bottom 0.61: R53.P2 108.82,123.51 Q4.1
N$246
  Bottom 0.61: R56.P2 108.82,134.81 Q5.1
N$247
  Bottom 0.61: R81.P2 108.82,131.26 Q6.1
N$248
  Bottom 0.61: R83.P2 108.82,138.37 Q8.1
N$252
  Bottom 0.61: R33.P2 124.21,102.23 D5.P13
N$254
  Bottom 0.61: R34.P2 78.74,104.78 D5.P3
N$256
  Bottom 0.61: R35.P2 78.74,102.23 D5.P4
N$258
  Bottom 0.61: R36.P2 124.21,94.61 D5.P10
N$260
  Bottom 0.61: R37.P2 78.74,97.16 D5.P6
N$262
  Bottom 0.61: R38.P2 124.21,97.16 D5.P11
N$264
  Bottom 0.61: R39.P2 124.21,107.31 D5.P15
N$266
  Bottom 0.61: R40.P2 124.21,109.86 D5.P16
N$308
  Bottom 0.61: R41.P2 184.4,102.23 D6.P13
N$310
  Bottom 0.61: R42.P2 138.94,104.78 D6.P3
N$312
  Bottom 0.61: R43.P2 138.94,102.23 D6.P4
N$314
  Bottom 0.61: R44.P2 184.4,94.61 D6.P10
N$316
  Bottom 0.61: R45.P2 138.94,97.16 D6.P6
N$318
  Bottom 0.61: R46.P2 184.4,97.16 D6.P11
N$320
  Bottom 0.61: R47.P2 184.4,107.31 D6.P15
N$322
  Bottom 0.61: R48.P2 184.4,109.86 D6.P16
N$369
  Bottom 0.61: R57.P2 63.88,41.91 D8.P13
N$371
  Bottom 0.61: R58.P2 18.67,44.45 D8.P3
N$373
  Bottom 0.61: R59.P2 18.67,41.91 D8.P4
N$375
  Bottom 0.61: R60.P2 63.88,34.29 D8.P10
N$377
  Bottom 0.61: R61.P2 18.67,36.83 D8.P6
N$379
  Bottom 0.61: R62.P2 63.88,36.83 D8.P11
N$381
  Bottom 0.61: R63.P2 63.88,46.99 D8.P15
N$383
  Bottom 0.61: D8.P16 63.88,49.53 R64.P2
N$428
  Bottom 0.61: R65.P2 124.08,41.91 D9.P13
N$430
  Bottom 0.61: R66.P2 78.87,44.45 D9.P3
N$432
  Bottom 0.61: R67.P2 78.87,41.91 D9.P4
N$434
  Bottom 0.61: R68.P2 124.08,34.29 D9.P10
N$436
  Bottom 0.61: R69.P2 78.87,36.83 D9.P6
N$438
  Bottom 0.61: R70.P2 124.08,36.83 D9.P11
N$440
  Bottom 0.61: R71.P2 124.08,46.99 D9.P15
N$442
  Bottom 0.61: R72.P2 124.08,49.53 D9.P16
N$484
  Bottom 0.61: R73.P2 184.28,41.91 D10.P13
N$486
  Bottom 0.61: R74.P2 139.06,44.45 D10.P3
N$488
  Bottom 0.61: R75.P2 139.06,41.91 D10.P4
N$490
  Bottom 0.61: R76.P2 184.28,34.29 D10.P10
N$492
  Bottom 0.61: R77.P2 139.06,36.83 D10.P6
N$494
  Bottom 0.61: R78.P2 184.28,36.83 D10.P11
N$496
  Bottom 0.61: R79.P2 184.28,46.99 D10.P15
N$498
  Bottom 0.61: R80.P2 184.28,49.53 D10.P16
PSCK
  Bottom 0.406: U7.P17 73.92,119.75 79.38,114.3 85.72,114.3 85.72,116.84 J2.P3
RCK  (via drill 0.6)
  Top 0.61: v110.49,40.64 v110.49,54.61 | v110.49,84.45 v110.49,100.97 v110.49,161.29 | v41.27,40.64 v41.27,54.61 | v41.27,92.08 v41.27,100.97 v41.27,122.56 v41.27,161.29 | v161.93,40.64 v161.93,54.61 | v161.93,87.63 v161.93,100.97 v161.93,161.29 | v41.27,73.66 v110.49,73.66 v161.93,73.66
  Bottom 0.406: U7.P25 66.67,122.56
  Bottom 0.61: U11.12 v110.49,40.64 | v110.49,54.61 v110.49,73.66 v110.49,84.45 | v110.49,161.29 U2.12 | U5.12 v110.49,100.97 | U10.12 v41.27,40.64 | v41.27,54.61 v41.27,73.66 v41.27,92.08 | v41.27,161.29 U1.12 | U4.12 v41.27,100.97 | U12.12 v161.93,40.64 | v161.93,54.61 v161.93,73.66 v161.93,87.63 | v161.93,161.29 U3.12 | U6.12 v161.93,100.97 | 66.67,122.56 v41.27,122.56
ROW0  (via drill 0.6)
  Top 0.61: v66.04,147.96 v66.04,111.76 | v66.04,31.75 64.39,31.75 D8.P9 | D4.P9 64.26,92.08 v66.04,92.08 | v126.36,31.75 124.59,31.75 D9.P9 | D10.P9 184.78,31.75 v186.69,31.75 | D6.P9 184.66,92.08 v186.69,92.08 | D5.P9 124.33,92.08 v126.36,92.08 | v66.04,71.12 v126.36,71.12 v186.69,71.12
  Bottom 0.61: D1.P9 66.04,152.4 v66.04,147.96 | v66.04,111.76 v66.04,92.08 v66.04,71.12 v66.04,31.75 | D2.P9 126.36,152.4 126.36,116.84 | 126.36,116.84 v126.36,92.08 v126.36,71.12 v126.36,31.75 | D3.P9 186.69,152.4 v186.69,92.08 v186.69,71.12 v186.69,31.75 | Q1.3 126.36,116.84
ROW1  (via drill 0.6)
  Top 0.61: D4.P14 64.26,104.78 v68.58,104.78 | v68.58,111.76 v68.58,147.96 | D8.P14 64.39,44.45 v68.58,44.45 | D9.P14 124.59,44.45 v128.91,44.45 | D5.P14 124.46,104.78 v128.91,104.78 | D10.P14 184.78,44.45 v189.23,44.45 | v68.58,68.58 v128.91,68.58 v189.23,68.58 | D6.P14 184.66,104.78 v189.23,104.78 | v114.94,118.11 v128.91,118.11
  Bottom 0.61: v68.58,111.76 v68.58,104.78 v68.58,68.58 v68.58,44.45 | v68.58,147.96 68.58,165.1 D1.P14 | v128.91,44.45 v128.91,68.58 v128.91,104.78 v128.91,118.11 128.91,165.1 D2.P14 | v189.23,44.45 v189.23,68.58 v189.23,104.78 189.23,165.1 D3.P14 | Q2.3 112.86,118.92 113.67,118.11 v114.94,118.11
ROW2  (via drill 0.6)
  Top 0.61: D1.P8 v15.24,152.4 | v15.24,31.75 18.16,31.75 D8.P8 | D9.P8 78.36,31.75 v75.56,31.75 | v75.56,111.76 v75.56,147.96 | v75.56,152.4 D2.P8 | D5.P8 78.49,92.08 v75.56,92.08 | D4.P8 18.29,92.08 v15.24,92.08 | D3.P8 v135.89,152.4 | v135.89,31.75 138.56,31.75 D10.P8 | D6.P8 138.68,92.08 v135.89,92.08 | v15.24,80.01 v75.56,80.01 v135.89,80.01 | v117.47,120.65 v135.89,120.65
  Bottom 0.61: v15.24,152.4 v15.24,92.08 v15.24,80.01 v15.24,31.75 | v75.56,111.76 v75.56,92.08 v75.56,80.01 v75.56,31.75 | v75.56,147.96 v75.56,152.4 | v135.89,152.4 v135.89,120.65 v135.89,92.08 v135.89,80.01 v135.89,31.75 | Q3.3 114.94,128.27 115.57,127.64 115.57,121.28 116.2,120.65 v117.47,120.65
ROW3  (via drill 0.6)
  Top 0.61: D1.P12 v67.31,160.02 | v67.31,147.96 v67.31,111.76 | v67.31,39.37 64.39,39.37 D8.P12 | D4.P12 64.26,99.69 v67.31,99.69 | D2.P12 v127.64,160.02 | v127.64,39.37 124.59,39.37 D9.P12 | D3.P12 v187.96,160.02 | v187.96,39.37 184.78,39.37 D10.P12 | D6.P12 184.66,99.69 v187.96,99.69 | D5.P12 124.46,99.69 v127.64,99.69 | v187.96,69.85 v127.64,69.85 v67.31,69.85 | v116.2,119.38 v127.64,119.38
  Bottom 0.61: v67.31,160.02 v67.31,147.96 | v67.31,111.76 v67.31,99.69 v67.31,69.85 v67.31,39.37 | v127.64,160.02 v127.64,119.38 v127.64,99.69 v127.64,69.85 v127.64,39.37 | v187.96,160.02 v187.96,99.69 v187.96,69.85 v187.96,39.37 | Q4.3 113.67,124.46 114.3,123.83 114.3,120.02 114.94,119.38 v116.2,119.38
ROW4  (via drill 0.6)
  Top 0.61: D8.P1 18.16,49.53 v11.43,49.53 | v11.43,170.18 D1.P1 | D4.P1 18.29,109.86 v11.43,109.86 | D9.P1 78.36,49.53 v71.75,49.53 | v71.75,111.76 v71.75,147.96 | v71.75,170.18 D2.P1 | D5.P1 78.49,109.86 v71.75,109.86 | D3.P1 v132.08,170.18 | v132.08,49.53 138.56,49.53 D10.P1 | D6.P1 138.68,109.86 v132.08,109.86 | v11.43,76.2 v71.75,76.2 v132.08,76.2 | v120.02,123.19 v132.08,123.19
  Bottom 0.61: v11.43,170.18 v11.43,109.86 v11.43,76.2 v11.43,49.53 | v71.75,111.76 v71.75,109.86 v71.75,76.2 v71.75,49.53 | v71.75,147.96 v71.75,170.18 | v132.08,170.18 v132.08,123.19 v132.08,109.86 v132.08,76.2 v132.08,49.53 | Q5.3 113.79,135.76 118.11,131.44 118.11,123.83 118.75,123.19 v120.02,123.19
ROW5  (via drill 0.6)
  Top 0.61: D1.P7 v16.51,154.94 | v16.51,34.29 18.16,34.29 D8.P7 | v16.51,94.61 18.29,94.61 D4.P7 | D9.P7 78.36,34.29 v76.83,34.29 | v76.83,111.76 v76.83,147.96 | v76.83,154.94 D2.P7 | D5.P7 78.49,94.61 v76.83,94.61 | D3.P7 v137.16,154.94 | v137.16,34.29 138.81,34.29 D10.P7 | D6.P7 138.68,94.61 v137.16,94.61 | v16.51,81.28 v76.83,81.28 v137.16,81.28 | v118.75,121.92 v137.16,121.92
  Bottom 0.61: v16.51,154.94 v16.51,94.61 v16.51,81.28 v16.51,34.29 | v76.83,111.76 v76.83,94.61 v76.83,81.28 v76.83,34.29 | v76.83,147.96 v76.83,154.94 | v137.16,154.94 v137.16,121.92 v137.16,94.61 v137.16,81.28 v137.16,34.29 | Q6.3 115.44,132.21 116.84,130.81 116.84,122.56 117.47,121.92 v118.75,121.92
ROW6  (via drill 0.6)
  Top 0.61: D8.P2 18.16,46.99 v12.7,46.99 | v12.7,167.64 D1.P2 | D4.P2 18.29,107.31 v12.7,107.31 | D9.P2 78.36,46.99 v73.03,46.99 | v73.03,111.76 v73.03,147.96 | v73.03,167.64 D2.P2 | D5.P2 78.49,107.31 v73.03,107.31 | D3.P2 v133.35,167.64 | v133.35,46.99 138.56,46.99 D10.P2 | D6.P2 138.68,107.31 v133.35,107.31 | v12.7,77.47 v73.03,77.47 v133.35,77.47 | v122.56,125.73 v133.35,125.73
  Bottom 0.61: v12.7,167.64 v12.7,107.31 v12.7,77.47 v12.7,46.99 | v73.03,111.76 v73.03,107.31 v73.03,77.47 v73.03,46.99 | v73.03,147.96 v73.03,167.64 | v133.35,167.64 v133.35,125.73 v133.35,107.31 v133.35,77.47 v133.35,46.99 | Q7.3 114.3,141.44 114.3,139.06 120.65,132.72 120.65,126.36 121.28,125.73 v122.56,125.73
ROW7  (via drill 0.6)
  Top 0.61: D1.P5 v13.97,160.02 | v13.97,39.37 18.16,39.37 D8.P5 | D4.P5 18.29,99.69 v13.97,99.69 | D9.P5 78.36,39.37 v74.3,39.37 | v74.3,111.76 v74.3,147.96 | v74.3,160.02 D2.P5 | D5.P5 78.49,99.69 v74.3,99.69 | D3.P5 v134.62,160.02 | v134.62,39.37 138.56,39.37 D10.P5 | D6.P5 138.68,99.69 v134.62,99.69 | v13.97,78.74 v74.3,78.74 v134.62,78.74 | v121.28,124.46 v134.62,124.46
  Bottom 0.61: v13.97,160.02 v13.97,99.69 v13.97,78.74 v13.97,39.37 | v74.3,111.76 v74.3,99.69 v74.3,78.74 v74.3,39.37 | v74.3,147.96 v74.3,160.02 | v134.62,160.02 v134.62,124.46 v134.62,99.69 v134.62,78.74 v134.62,39.37 | Q8.3 112.86,138.6 119.38,132.08 119.38,125.09 120.02,124.46 v121.28,124.46
SCK  (via drill 0.6)
  Top 0.61: v45.09,162.56 v45.09,150.5 v107.31,150.5 | v158.75,150.5 v116.84,150.5 v116.84,162.56 | v165.74,150.5 v165.74,162.56 | v99.06,90.17 v45.09,90.17 v45.09,102.23 v45.09,130.18 v45.09,147.96 | v115.57,102.23 v115.57,90.17 v158.75,90.17 | v165.74,102.23 v165.74,90.17 | v45.09,52.7 v45.09,41.91 | v115.57,55.88 v115.57,41.91 | v165.74,55.88 v165.74,41.91
  Bottom 0.406: 66.04,130.18 66.67,129.54 66.67,128.69 U7.P32
  Bottom 0.61: U1.11 v45.09,162.56 | v107.31,150.5 v116.84,150.5 | v116.84,162.56 U2.11 | v158.75,150.5 v165.74,150.5 | v165.74,162.56 U3.11 | U4.11 v45.09,102.23 | v99.06,90.17 v115.57,90.17 v115.57,55.88 | v115.57,102.23 U5.11 | U6.11 v165.74,102.23 | v158.75,90.17 v165.74,90.17 v165.74,55.88 | v45.09,147.96 v45.09,150.5 | v45.09,90.17 v45.09,52.7 | v45.09,41.91 U10.11 | v115.57,41.91 U11.11 | v165.74,41.91 U12.11 | v45.09,130.18 66.04,130.18
SDATA1  (via drill 0.6)
  Top 0.61: v48.9,125.09 v48.9,147.96 | v48.9,151.76 48.9,156.84 v46.99,158.75
  Bottom 0.406: U7.P27 49.56,124.43 v48.9,125.09
  Bottom 0.61: v48.9,147.96 v48.9,151.76 | v46.99,158.75 U1.14
SDATA2  (via drill 0.6)
  Top 0.61: v47.62,98.42 v47.62,123.83
  Bottom 0.406: 47.82,123.63 U7.P26
  Bottom 0.61: v47.62,98.42 U4.14 | v47.62,123.83 47.82,123.63
SDATA3  (via drill 0.6)
  Top 0.61: v51.44,52.7 51.44,40.64 v48.9,38.1 | v51.44,127 v51.44,92.08
  Bottom 0.406: U7.P28 53.2,125.23 v51.44,127
  Bottom 0.61: v48.9,38.1 U10.14 | v51.44,92.08 v51.44,52.7

## Text on the board
bPlace: 5VDC, 2A | QR Clock | v2.0 1/13/2013